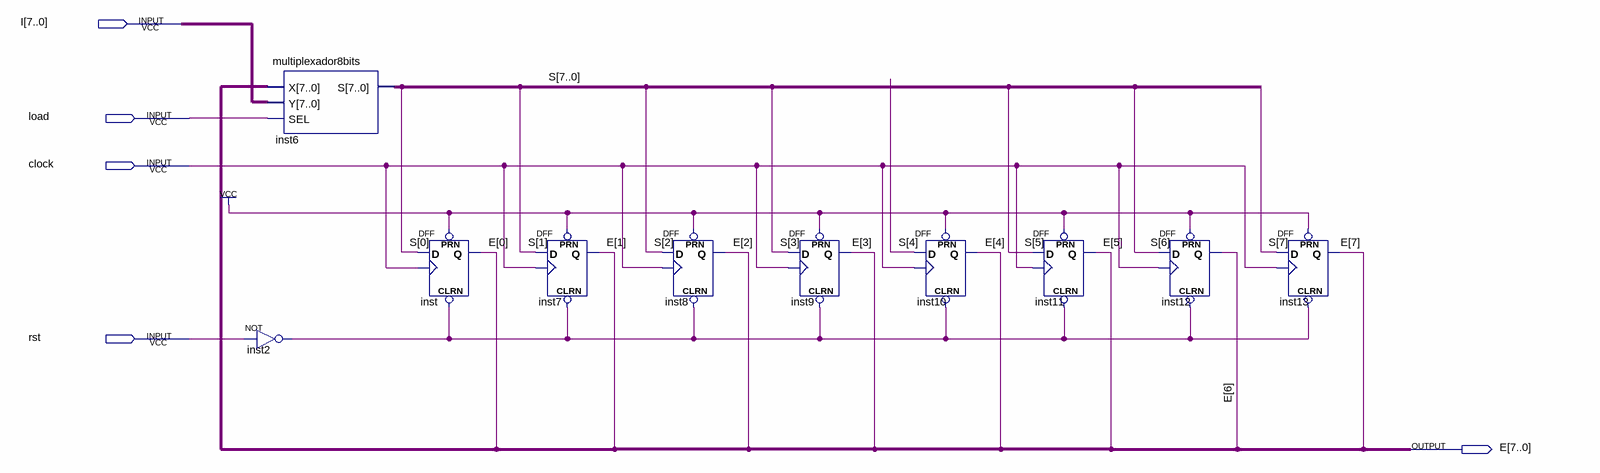
[diagram p0: schematic sheet]
// Quartus schematic registrador8bits.bdf as structural Verilog: 10 symbols, 5 pins
module registrador8bits (
  input  [7:0] I,
  input  load,
  input  clock,
  input  rst,
  output [7:0] E
);

  wire inst2_out;
  wire [7:0] S;

  multiplexador8bits inst6 (.X(E), .Y(I), .SEL(load), .S(S));
  not inst2 (inst2_out, rst);
  DFF inst (.CLRN(inst2_out), .CLK(clock), .D(S[0]), .PRN(1'b1), .Q(E[0]));
  DFF inst7 (.CLRN(inst2_out), .CLK(clock), .D(S[1]), .PRN(1'b1), .Q(E[1]));
  DFF inst8 (.CLRN(inst2_out), .CLK(clock), .D(S[2]), .PRN(1'b1), .Q(E[2]));
  DFF inst9 (.CLRN(inst2_out), .CLK(clock), .D(S[3]), .PRN(1'b1), .Q(E[3]));
  DFF inst10 (.CLRN(inst2_out), .CLK(clock), .D(S[4]), .PRN(1'b1), .Q(E[4]));
  DFF inst11 (.CLRN(inst2_out), .CLK(clock), .D(S[5]), .PRN(1'b1), .Q(E[5]));
  DFF inst12 (.CLRN(inst2_out), .CLK(clock), .D(S[6]), .PRN(1'b1), .Q(E[6]));
  DFF inst13 (.CLRN(inst2_out), .CLK(clock), .D(S[7]), .PRN(1'b1), .Q(E[7]));
endmodule
